# Altium schematic sheet CC3D_V2.SchDoc: CopterControl 3D
size A3; Author: David Ankers; DrawnBy: David Ankers; Engineer: David Ankers; Organization: The OpenPilot Project; DocumentNumber: 1; Revision: A; SheetNumber: 1; SheetTotal: 1; License: Creative Commons BY-SA; ProjectName: OpenPilot
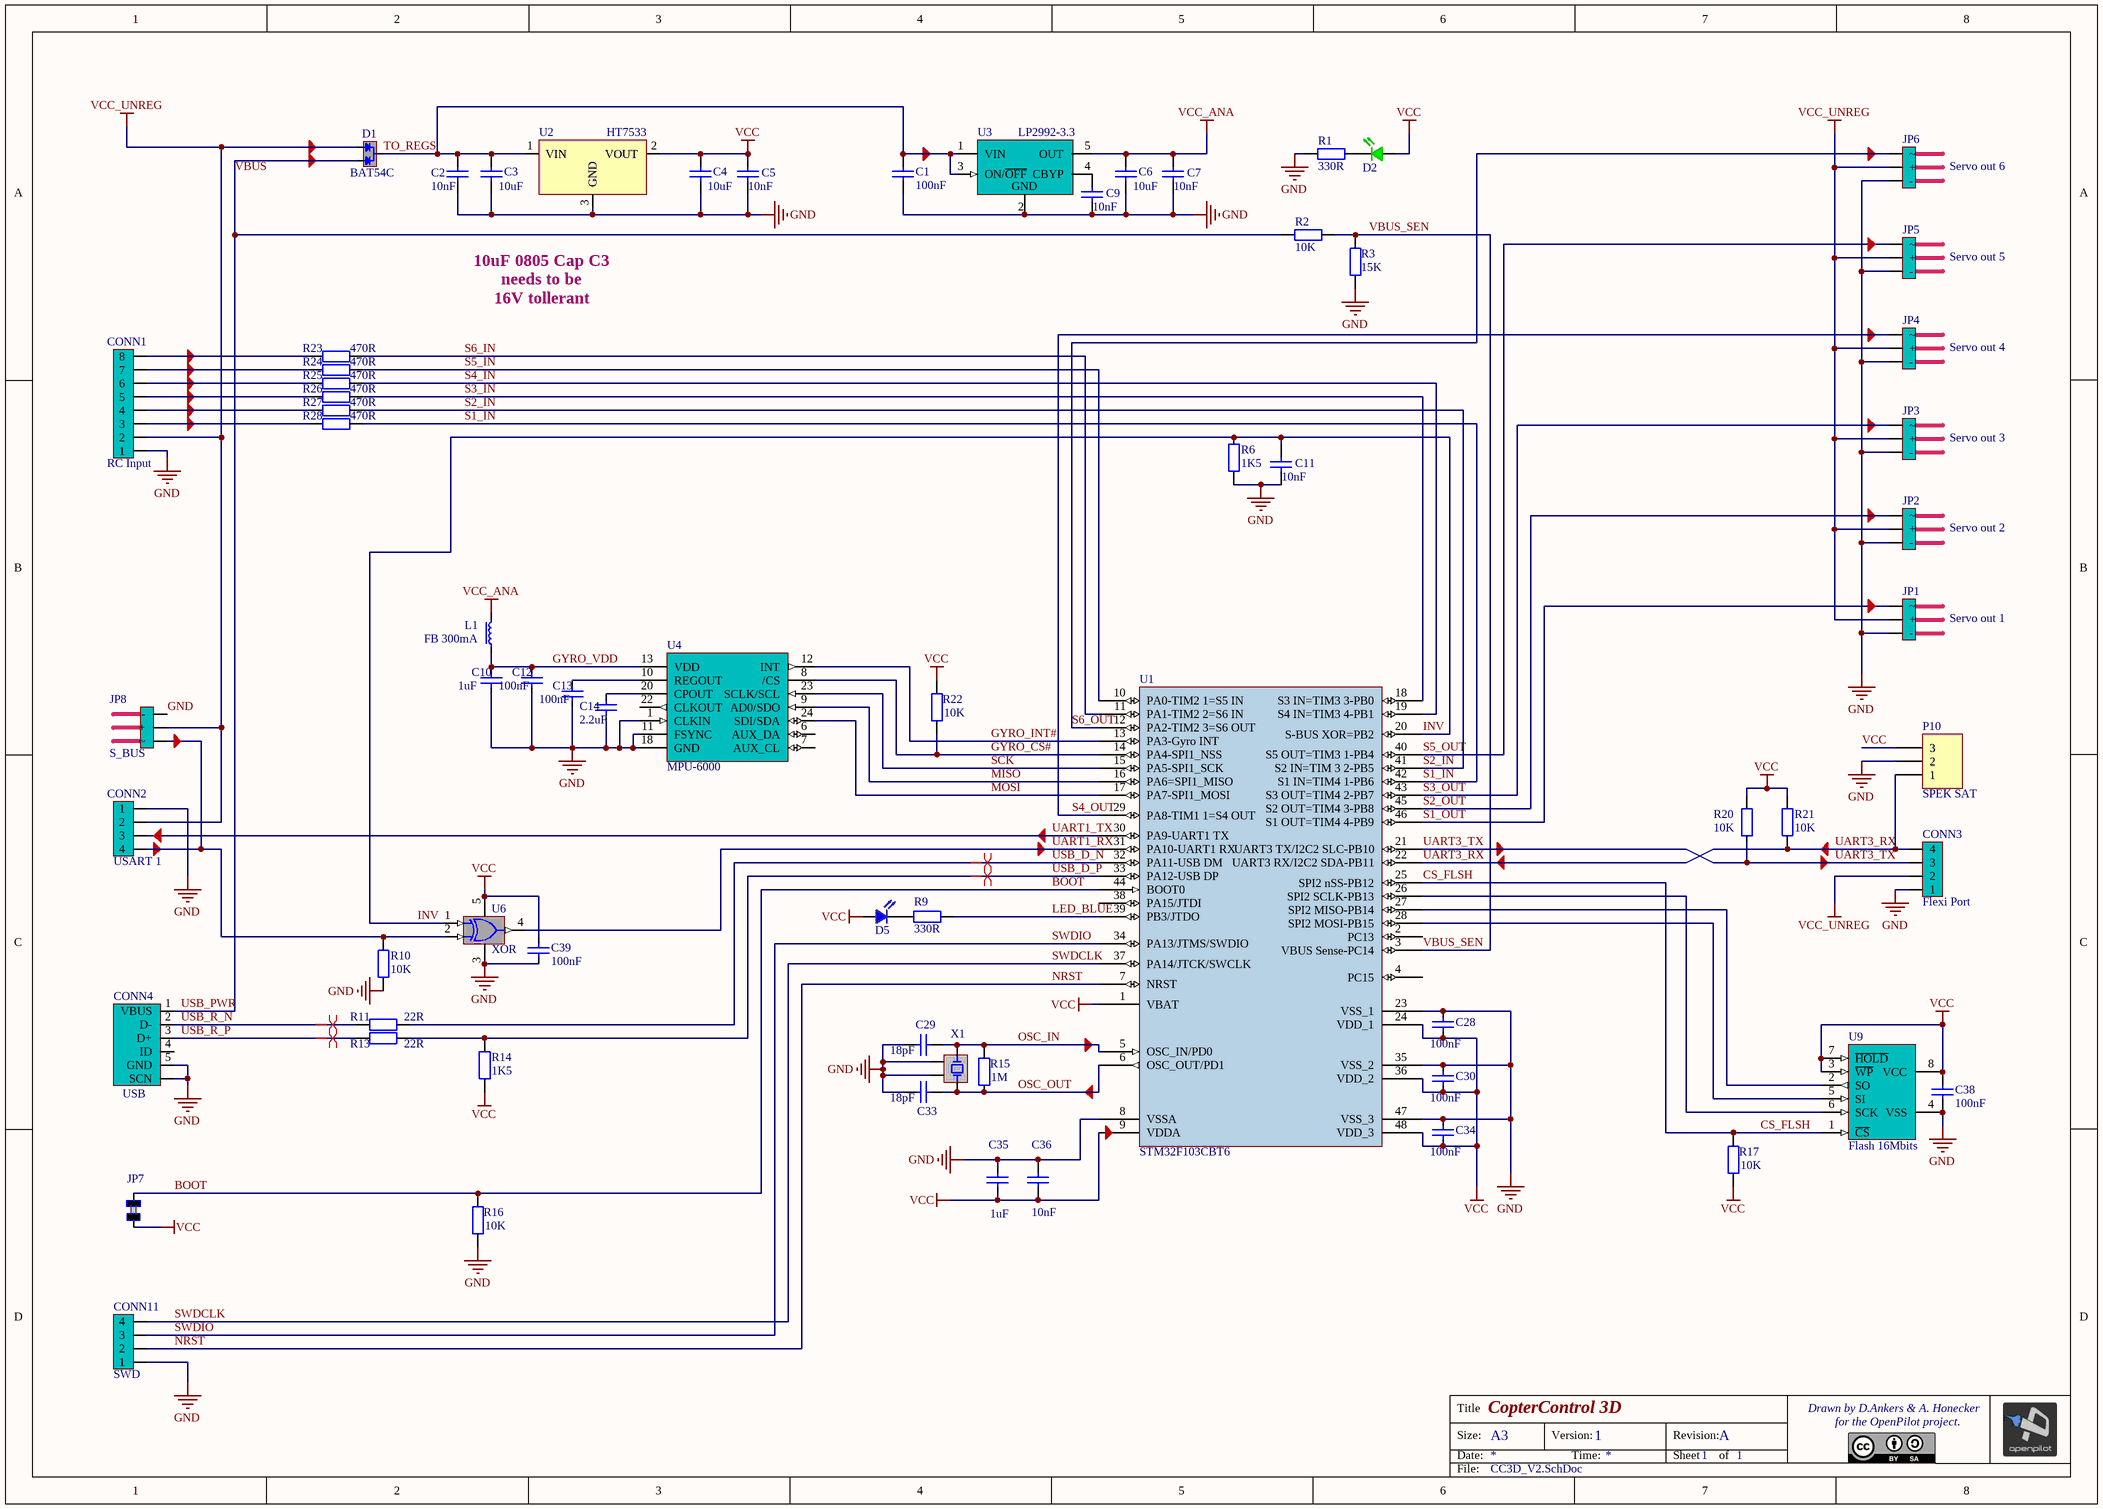
[diagram p0: CC3D_V2.SchDoc]

## Parts
C1  value 100nF  [CAP603N]  (hidden comment: Cap603)
C2  value 10nF  [CAP603L]  (hidden comment: Cap603)
C3  value 10uF  [CAP805L]  (hidden comment: Cap805)
C4  value 10uF  [CAP805L]  (hidden comment: Cap805)
C5  value 10nF  [CAP603N]  (hidden comment: Cap603)
C6  value 10uF  [CAP805L]  (hidden comment: Cap805)
C7  value 10nF  [CAP603N]  (hidden comment: Cap603)
C9  value 10nF  [CAP603N]  (hidden comment: Cap603)
C10  value 1uF  [CAP603L]  (hidden comment: Cap603)
C11  value 10nF  [CAP603N]  (hidden comment: Cap603)
C12  value 100nF  [CAP603L]  (hidden comment: Cap603)
C13  value 100nF  [CAP603L]  (hidden comment: Cap603)
C14  value 2.2uF  [CAP603L]  (hidden comment: Cap603)
C28  value 100nF  [CAP603N]  (hidden comment: Cap603)
C29  value 18pF  [CAP603N]  (hidden comment: Cap603)
C30  value 100nF  [CAP603N]  (hidden comment: Cap603)
C33  value 18pF  [CAP603N]  (hidden comment: Cap603)
C34  value 100nF  [CAP603N]  (hidden comment: Cap603)
C35  value 1uF  [CAP603L]  (hidden comment: Cap603)
C36  value 10nF  [CAP603N]  (hidden comment: Cap603)
C38  value 100nF  [CAP603N]  (hidden comment: Cap603)
C39  value 100nF  [CAP603N]  (hidden comment: Cap603)
CONN1  RC Input  [JST SH 8 Pin Side Entry]
CONN2  USART 1  [JST SH 4 Pin Side Entry]
CONN3  Flexi Port  [JST SH 4 Pin Side Entry]
CONN4  USB  [USB SMD]
CONN11  SWD  [JST SH 4 Pin Side Entry]
D1  BAT54C  [SOT23-3N]
D2  Green  [LED603N]  (value not drawn)
D5  Blue  [LED603N]  (value not drawn)
JP1  Servo out 1  [SIP3 - 0.1]
JP2  Servo out 2  [SIP3 - 0.1]
JP3  Servo out 3  [SIP3 - 0.1]
JP4  Servo out 4  [SIP3 - 0.1]
JP5  Servo out 5  [SIP3 - 0.1]
JP6  Servo out 6  [SIP3 - 0.1]
JP7  2 PAD Touch JMP  [TOUCH JMP 2PAD]  (value not drawn)
JP8  S_BUS  [SIP3 - SMT]
L1  FB 300mA  [IND603N]
P10  SPEK SAT  [1.5*3_SMT]
R1  value 330R  [RES603N]  (hidden comment: Res603)
R2  value 10K  [RES603N]  (hidden comment: Res603)
R3  value 15K  [RES603N]  (hidden comment: Res603)
R6  value 1K5  [RES603N]  (hidden comment: Res603)
R9  value 330R  [RES603N]  (hidden comment: Res603)
R10  value 10K  [RES603N]  (hidden comment: Res603)
R11  value 22R  [RES603N]  (hidden comment: Res603)
R13  value 22R  [RES603N]  (hidden comment: Res603)
R14  value 1K5  [RES603N]  (hidden comment: Res603)
R15  value 1M  [RES603N]  (hidden comment: Res603)
R16  value 10K  [RES603N]  (hidden comment: Res603)
R17  value 10K  [RES603N]  (hidden comment: Res603)
R20  value 10K  [RES603N]  (hidden comment: Res603)
R21  value 10K  [RES603N]  (hidden comment: Res603)
R22  value 10K  [RES603N]  (hidden comment: Res603)
R23  value 470R  [RES603N]  (hidden comment: Res603)
R24  value 470R  [RES603N]  (hidden comment: Res603)
R25  value 470R  [RES603N]  (hidden comment: Res603)
R26  value 470R  [RES603N]  (hidden comment: Res603)
R27  value 470R  [RES603N]  (hidden comment: Res603)
R28  value 470R  [RES603N]  (hidden comment: Res603)
U1  STM32F103CBT6  [STM32 48 Lead]
U2  HT7533  [SOT89]
U3  LP2992-3.3  [SOT23-5L]
U4  MPU-6000  [IMU-3000]
U6  XOR  [DCK-5]
U9  Flash 16Mbits  [SOIC8_N]
X1  8MHz  [XTAL ACT530SMX-4 Series]  (value not drawn)

## Nets
GND: C1.2 C2.2 C3.2 C4.2 C5.2 C6.2 C7.2 C9.2 C10.2 C11.2 C12.2 C13.2 C14.1 C28.1 C29.1 C30.1 C33.1 C34.1 C35.2 C36.1 C38.2 C39.2 CONN1.1 CONN2.1 CONN3.1 CONN4.0(SCN) CONN4.5(GND) CONN11.1 JP1.3(-) JP2.3(-) JP3.3(-) JP4.3(-) JP5.3(-) JP6.3(-) JP8.3(-) P10.2 R1.1 R3.1 R6.1 R10.1 R16.1 U1.8(VSSA) U1.23(VSS_1) U1.35(VSS_2) U1.47(VSS_3) U2.3(GND) U3.2(GND) U4.1(CLKIN) U4.11(FSYNC) U4.18(GND) U6.3(GND) U9.4(VSS) X1.2 X1.4
VCC: C4.1 C5.1 C28.2 C30.2 C34.2 C35.1 C36.2 C38.1 C39.1 D2.2(A) D5.2(A) JP7.2 P10.3 R14.1 R17.1 R20.2 R21.2 R22.2 U1.1(VBAT) U1.9(VDDA) U1.24(VDD_1) U1.36(VDD_2) U1.48(VDD_3) U2.2(VOUT) U6.5(VCC) U9.3(~{WP}) U9.7(~{HOLD}) U9.8(VCC)
VCC_ANA: C6.1 C7.1 L1.2 U3.5(OUT)
VCC_UNREG: CONN1.2 CONN2.2 CONN3.2 D1.2(A2) JP1.2(+) JP2.2(+) JP3.2(+) JP4.2(+) JP5.2(+) JP6.2(+) JP8.2(+)
BOOT: JP7.1 R16.2 U1.44(BOOT0)
CS_FLSH: R17.2 U1.25(SPI2_nSS-PB12) U9.1(~{CS})
GYRO_CS#: R22.1 U1.14(PA4-SPI1_NSS) U4.8(/CS)
GYRO_INT#: U1.13(PA3-Gyro_INT) U4.12(INT)
GYRO_VDD: C10.1 C12.1 L1.1 U4.13(VDD)
INV: C11.1 R6.2 U1.20(S-BUS_XOR=PB2) U6.1(A)
LED_BLUE: R9.2 U1.39(PB3/JTDO)
MISO: U1.16(PA6=SPI1_MISO) U4.9(AD0/SDO)
MOSI: U1.17(PA7-SPI1_MOSI) U4.24(SDI/SDA)
NRST: CONN11.2 U1.7(NRST)
OSC_IN: C29.2 R15.2 U1.5(OSC_IN/PD0) X1.3
OSC_OUT: C33.2 R15.1 U1.6(OSC_OUT/PD1) X1.1
S1_IN: R28.1 U1.42(S1_IN=TIM4_1-PB6)
S1_OUT: JP1.1 U1.46(S1_OUT=TIM4_4-PB9)
S2_IN: R27.1 U1.41(S2_IN=TIM_3_2-PB5)
S2_OUT: JP2.1 U1.45(S2_OUT=TIM4_3-PB8)
S3_IN: R26.1 U1.18(S3_IN=TIM3_3-PB0)
S3_OUT: JP3.1 U1.43(S3_OUT=TIM4_2-PB7)
S4_IN: R25.1 U1.19(S4_IN=TIM3_4-PB1)
S4_OUT: JP4.1 U1.29(PA8-TIM1_1=S4_OUT)
S5_IN: R24.1 U1.10(PA0-TIM2_1=S5_IN)
S5_OUT: JP5.1 U1.40(S5_OUT=TIM3_1-PB4)
S6_IN: R23.1 U1.11(PA1-TIM2_2=S6_IN)
S6_OUT: JP6.1 U1.12(PA2-TIM2_3=S6_OUT)
SCK: U1.15(PA5-SPI1_SCK) U4.23(SCLK/SCL)
SWDCLK: CONN11.4 U1.37(PA14/JTCK/SWCLK)
SWDIO: CONN11.3 U1.34(PA13/JTMS/SWDIO)
TO_REGS: C1.1 C2.1 C3.1 D1.3(COM) U2.1(VIN) U3.1(VIN) U3.3(ON/~{OFF})
UART1_RX: U1.31(PA10-UART1_RX) U6.4(Y)
UART1_TX: CONN2.3 U1.30(PA9-UART1_TX)
UART3_RX: CONN3.4 P10.1 R21.1 U1.22(UART3_RX/I2C2_SDA-PB11)
UART3_TX: CONN3.3 R20.1 U1.21(UART3_TX/I2C2_SLC-PB10)
USB_D_N: R11.1 U1.32(PA11-USB_DM)
USB_D_P: R13.1 R14.2 U1.33(PA12-USB_DP)
USB_PWR: CONN4.1(VBUS) D1.1(A1) R2.1  [also labelled VBUS]
USB_R_N: CONN4.2(D-) R11.2
USB_R_P: CONN4.3(D+) R13.2
VBUS_SEN: R2.2 R3.2 U1.3(VBUS_Sense-PC14)
NetC9_1: C9.1 U3.4(CBYP)
NetC13_1: C13.1 U4.10(REGOUT)
NetC14_2: C14.2 U4.20(CPOUT)
NetCONN1_3: CONN1.3 R28.2
NetCONN1_4: CONN1.4 R27.2
NetCONN1_5: CONN1.5 R26.2
NetCONN1_6: CONN1.6 R25.2
NetCONN1_7: CONN1.7 R24.2
NetCONN1_8: CONN1.8 R23.2
NetCONN2_4: CONN2.4 JP8.1 R10.2 U6.2(B)
NetD2_1: D2.1(K) R1.2
NetD5_1: D5.1(K) R9.1
NetU1_26: U1.26(SPI2_SCLK-PB13) U9.6(SCK)
NetU1_27: U1.27(SPI2_MISO-PB14) U9.2(SO)
NetU1_28: U1.28(SPI2_MOSI-PB15) U9.5(SI)

Not connected (* = marked no-connect by the designer): CONN4 4(ID); U1 2(PC13) 4(PC15) 38(PA15/JTDI); U4 2(NC) 3(NC) 4(NC) 5(NC) 6(AUX_DA) 7(AUX_CL) 14(NC) 15(NC) 16(NC) 17(NC) 19(RESV) 21(RESV) 22(CLKOUT)

## Layout directives
differential pair: USB_D_N, USB_D_P, USB_R_N, USB_R_P

## Notes on the sheet
- 10uF 0805 Cap C3
  needs to be
  16V tollerant
- Title
- Size:
- Date:
- A3
- Version:
- Time:
- Revision:
- Sheet
- of
- Drawn by D.Ankers & A. Honecker
- for the OpenPilot project.
- File:

## Library data of the parts
C1 C2 C5 C7 C9-C14 C28-C30 C33-C36 C38 C39 = Cap603: Capacitor SMD; Published: 1-Nov-2010; LatestRevisionDate: 1-Nov-2010; LatestRevisionNote: Released OpenPilot Lib; PackageReference: 0603 (1608 Metric); Publisher: The OpenPilot Project; Supplier 1: Digi-Key
  C1 C12 C13 C28 C30 C34 C38 C39: Supplier Part Number 1: 399-5089-1-ND
  C2 C5 C7 C9 C11 C36: Supplier Part Number 1: 399-1091-1-ND
  C10 C35: Supplier Part Number 1: 445-5172-1-ND
  C14: Supplier Part Number 1: 445-5175-1-ND
  C29 C33: Supplier Part Number 1: 399-1052-1-ND
C3 C4 C6 = Cap805: Capacitor SMD; Published: 1-Nov-2010; LatestRevisionDate: 1-Nov-2010; LatestRevisionNote: Released OpenPilot Lib; PackageReference: 0805 (2012 Metric); Publisher: The OpenPilot Project; Supplier 1: Digi-Key; Supplier Part Number 1: 490-3886-1-ND
CONN1 = JST-SH 8-pin Side Entry Socket: Manufacturer: Generic Components; Class: Connector; Supplier 1: Digi-Key; Supplier Part Number 1: 455-1808-1-ND
CONN2 CONN3 CONN11 = JST-SH 4-pin Side Entry Socket: Manufacturer: Generic Components; Class: Connector; Supplier 1: Digi-Key; Supplier Part Number 1: 455-1804-1-ND
CONN4 = USB_SMT_B: USB Type-B SMT Socket; Class: Connector; Supplier 1: Digi-Key; Supplier Part Number 1: 670-1190-1-ND
D1 = BAT54C: Dual Diode Command Cathode; Supplier 1: Digi-Key; Supplier Part Number 1: 497-3786-1-ND
D2 = LED 603 Gr: Green 603 LED; Value: 2.1v 20mA; Supplier 1: Digi-Key; Supplier Part Number 1: 754-1116-1-ND
D5 = LED 603 Bl: Blue 603 LED; Supplier 1: Digi-Key; Supplier Part Number 1: 350-2037-1-ND
JP1-JP6 JP8 = Hdr 3 Pin 0.1: Header, 3-Pin, 0.1"; Manufacturer: Generic Components; Class: Connector; Supplier 1: Digi-Key; Supplier Part Number 1: MTLW-103-23-S-S-260-ND
JP7 = 2 PAD Touch JMP: 2 Pad Touch Jumper; LatestRevisionDate: 1-Nov-2010; LatestRevisionNote: Released OpenPilot Lib; Published: 1-Nov-2010; Publisher: The OpenPilot Project
L1 = FerriteBead_300mA: Ferrite Bead 300mA; Manufacturer: Generic Components; Class: Passive; Supplier 1: Digi-Key; Supplier Part Number 1: 732-1586-1-ND
P10 = Header 3: Header, 3-Pin; LatestRevisionDate: 17-Jul-2002; LatestRevisionNote: Re-released for DXP Platform.; Publisher: Altium Limited
R1-R3 R6 R9-R11 R13-R17 R20-R28 = Res603: Resistor SMD; Published: 1-Nov-2010; LatestRevisionDate: 1-Nov-2010; LatestRevisionNote: Released OpenPilot Lib; PackageReference: 0402 (1005 Metric); Publisher: The OpenPilot Project; Supplier 1: Digi-Key
  R1 R9: Supplier Part Number 1: P330HCT-ND
  R2 R10 R16 R17 R20-R28: Supplier Part Number 1: P10.0KHCT-ND
  R3: Supplier Part Number 1: P15.0KHCT-ND
  R6 R14: Supplier Part Number 1: P1.50KHCT-ND
  R11 R13: Supplier Part Number 1: P22GCT-ND
  R15: Supplier Part Number 1: P1.0MGCT-ND
U1 = STM32F103CBT6: STM32 ARM-based 32-bit MCU with 128 Kbytes Flash, 48-pin LQFP, Industrial Temperature; Published: 30-May-2008; DatasheetVersion: rev6, Mar-2008; PackageVersion: Mar-2008; PackageReference: LQFP48; Publisher: Altium Limited; PackageDescription: 48-Pin Low-Profile Quad Flat Pack, 7 x 7 mm Body, 0.5 mm Pitch (LQFP48); ComponentLink1Description: Manufacturer Link; ComponentLink1URL: www.st.com/stm32; ComponentLink2Description: Datasheet; ComponentLink2URL: http://www.st.com/stonline/products/literature/ds/13587.pdf; Supplier 1: Digi-Key; Supplier Part Number 1: 497-6288-ND
U2 = HT75xx
U3 = LP2985-3.3: 3.3V 250mA LDO Regulator; Manufacturer: National Semiconductor; Manufacturer Part Number: LP2992AIM5-3.3/NOPB; Description: IC REG LDO MICRPWR 250MA SOT23-5; Regulator Topology: Positive Fixed; Voltage - Input: Up to 16V; Voltage - Dropout (Typical): 0.45V @ 250mA; Number of Regulators: 1; Supplier 1: Digi-Key; Supplier Part Number 1: LP2992AIM5-3.3CT-ND; RoHS: RoHS Compliant; Category: Integrated Circuits (ICs); Stock 1: 15821; Pricing 1: 1=1.86, 25=1.4712, 100=1.3239, 250=1.15224, 500=1.02966 (AUD); Voltage - Output: 3.3V; Current - Output: 250mA; Current - Limit (Min): -; Operating Temperature: -40°C ~ 125°C; Mounting Type: Surface Mount; Package / Case: SC-74A, SOT-753; Supplier Device Package: SOT-23-5; Packaging: Cut Tape (CT); ComponentLink1URL: http://www.national.com/ds/LP/LP2992.pdf; ComponentLink1Description: http://www.national.com/ds/LP/LP2992.pdf
U4 = MPU-3/6000: Invensense MPU-3/6000,  3-axis Gyros & Accel on 6000; ComponentLink2Description: Datasheet; LatestRevisionDate: 1-Nov-2010; LatestRevisionNote: Released OpenPilot Lib; Published: 1-Nov-2010; Publisher: The OpenPilot Project; Manufacturer: Invensense; Supplier 1: Invensense; Supplier Part Number 1: MPU-6000
U6 = XOR SN74LVC1G86DCKR: XOR Gate SN74LVC1G86DCKR; Supplier 1: Digi-Key; Supplier Part Number 1: 296-9854-1-ND
U9 = Flash 16Mb 75MHZ 8SOIC: 16Mbit SPI Flash Memory; ComponentLink2Description: Datasheet; LatestRevisionDate: 1-Nov-2010; LatestRevisionNote: Released OpenPilot Lib; Published: 1-Nov-2010; Publisher: The OpenPilot Project; Supplier 1: Digi-Key; Supplier Part Number 1: M25P16-VMN6P-ND
X1 = XTAL ACT530SMX-4: Surface Mount Quartz Crystal, Digikey 535-9720-1-ND; Class: Oscillator; SubClass: Crystal Oscillator; Supplier 1: Digi-Key; Supplier Part Number 1: 535-9720-1-ND